# Altium schematic sheet Top_Level.SchDoc: ESP32 ESP Home Template
size A4; DrawnBy: Tim Baker; Revision: 1; SheetNumber: 1; SheetTotal: 5
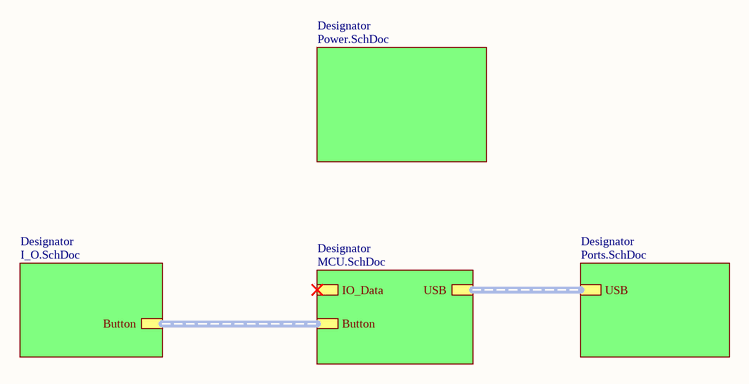
[diagram p0: Top_Level.SchDoc]

## Sub-sheets
Designator = I_O.SchDoc: Button (harness Button)
Designator = MCU.SchDoc: IO_Data (harness IO), USB (harness USB), Button (harness Button)
Designator = Ports.SchDoc: USB (harness USB)
Designator = Power.SchDoc: no entries